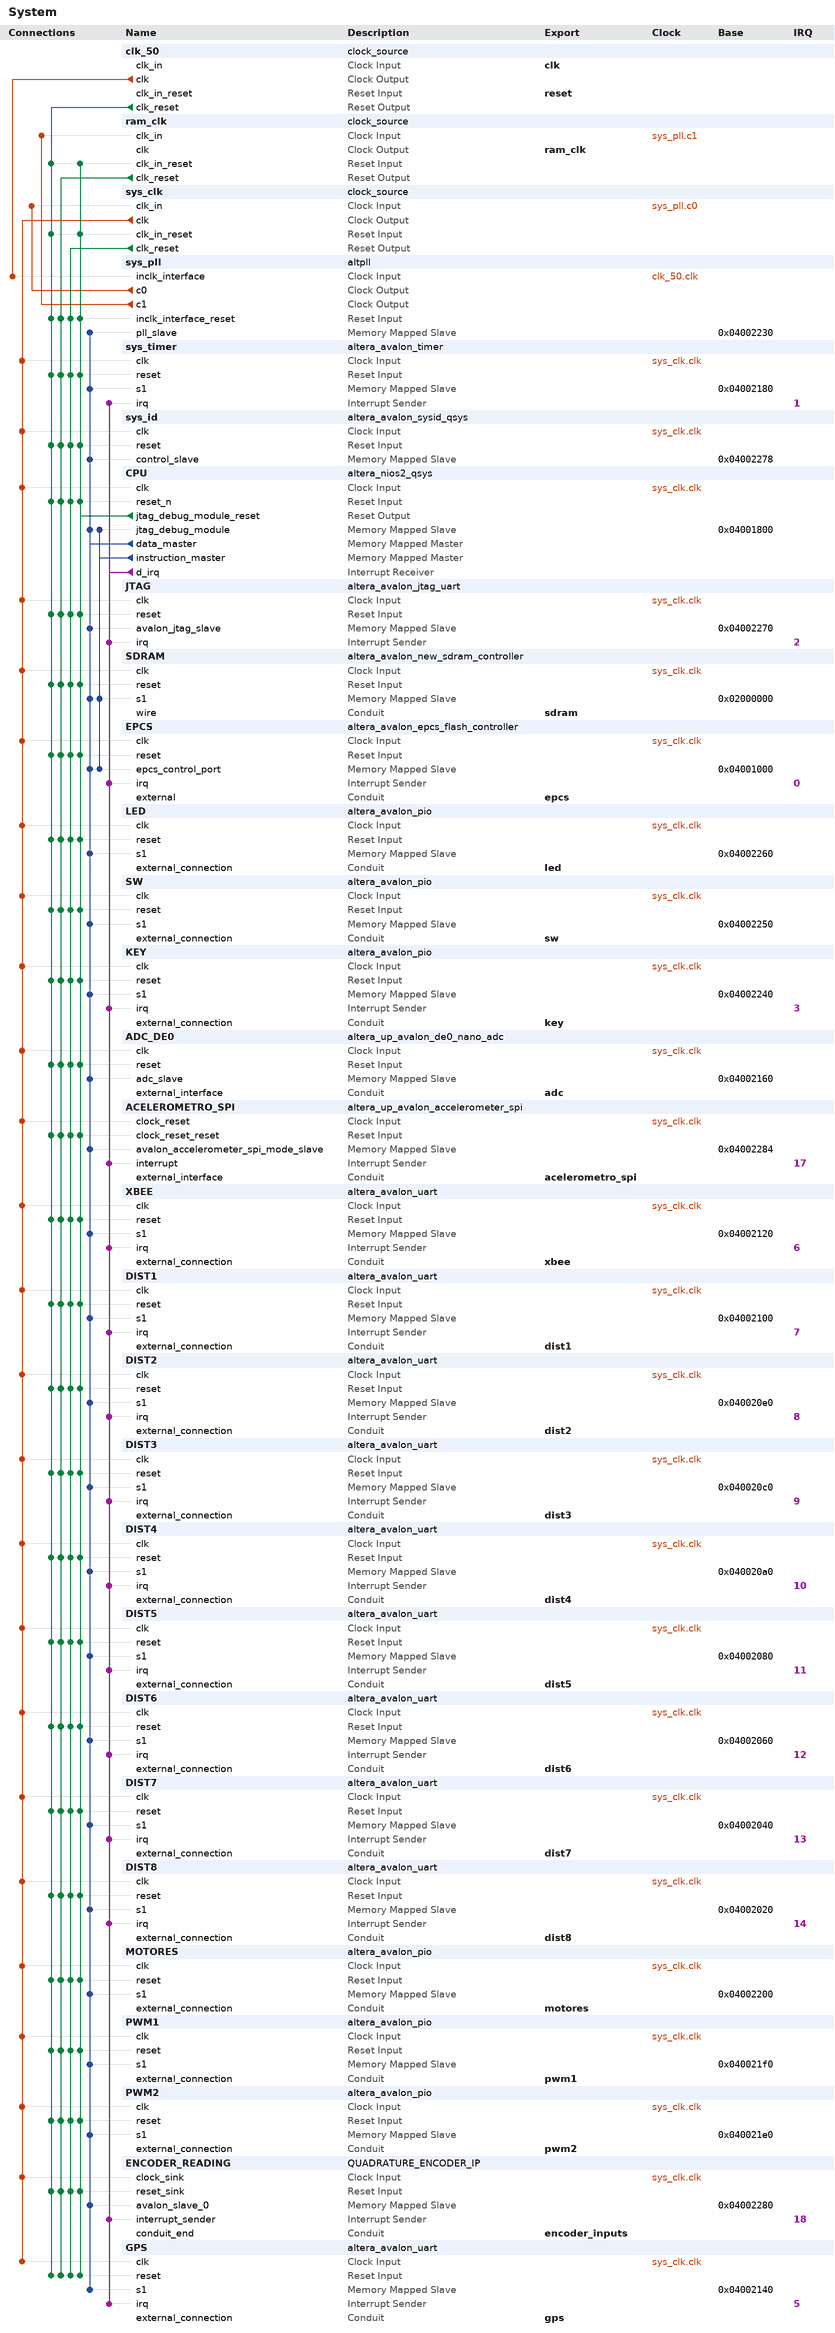
[diagram p0: system contents]
# Platform Designer (Qsys) system System, Cyclone IV E EP4CE22F17C6
# Parameters at their usual value, and those the tool derives, are not listed.
package require -exact qsys 13.1
create_system System
set_project_property DEVICE_FAMILY {Cyclone IV E}
set_project_property DEVICE EP4CE22F17C6

add_instance clk_50 clock_source 13.1
set_instance_parameter_value clk_50 clockFrequency 50000000

add_instance ram_clk clock_source 13.1
set_instance_parameter_value ram_clk clockFrequency 100000000

add_instance sys_clk clock_source 13.1
set_instance_parameter_value sys_clk clockFrequency 100000000

add_instance sys_pll altpll 13.1
set_instance_parameter_value sys_pll INCLK0_INPUT_FREQUENCY 20000
set_instance_parameter_value sys_pll CLK0_MULTIPLY_BY 2
set_instance_parameter_value sys_pll CLK1_MULTIPLY_BY 2
set_instance_parameter_value sys_pll CLK2_MULTIPLY_BY 1
set_instance_parameter_value sys_pll CLK0_DIVIDE_BY 1
set_instance_parameter_value sys_pll CLK1_DIVIDE_BY 1
set_instance_parameter_value sys_pll CLK2_DIVIDE_BY 250
set_instance_parameter_value sys_pll CLK1_PHASE_SHIFT -1667
set_instance_parameter_value sys_pll CLK2_PHASE_SHIFT 0
set_instance_parameter_value sys_pll CLK1_DUTY_CYCLE 50
set_instance_parameter_value sys_pll CLK2_DUTY_CYCLE 50
set_instance_parameter_value sys_pll PORT_clk1 PORT_USED
set_instance_parameter_value sys_pll PORT_clk2 PORT_USED
set_instance_parameter_value sys_pll PORT_clk3 PORT_UNUSED
set_instance_parameter_value sys_pll PORT_ARESET PORT_USED
set_instance_parameter_value sys_pll PORT_LOCKED PORT_USED

add_instance sys_timer altera_avalon_timer 13.1
set_instance_parameter_value sys_timer period 1
set_instance_parameter_value sys_timer periodUnits MSEC

add_instance sys_id altera_avalon_sysid_qsys 13.1
set_instance_parameter_value sys_id id 0

add_instance CPU altera_nios2_qsys 13.1
set_instance_parameter_value CPU resetSlave EPCS.epcs_control_port
set_instance_parameter_value CPU mmu_TLBMissExcSlave None
set_instance_parameter_value CPU exceptionSlave SDRAM.s1
set_instance_parameter_value CPU breakSlave CPU.jtag_debug_module
set_instance_parameter_value CPU impl Fast
set_instance_parameter_value CPU icache_size 4096

add_instance JTAG altera_avalon_jtag_uart 13.1
set_instance_parameter_value JTAG simInteractiveOptions NO_INTERACTIVE_WINDOWS

add_instance SDRAM altera_avalon_new_sdram_controller 13.1
set_instance_parameter_value SDRAM TAC 5.5
set_instance_parameter_value SDRAM TRCD 20.0
set_instance_parameter_value SDRAM TRP 20.0
set_instance_parameter_value SDRAM casLatency 3
set_instance_parameter_value SDRAM columnWidth 9
set_instance_parameter_value SDRAM dataWidth 16
set_instance_parameter_value SDRAM generateSimulationModel false
set_instance_parameter_value SDRAM model single_Micron_MT48LC4M32B2_7_chip
set_instance_parameter_value SDRAM numberOfBanks 4
set_instance_parameter_value SDRAM numberOfChipSelects 1
set_instance_parameter_value SDRAM powerUpDelay 100.0
set_instance_parameter_value SDRAM refreshPeriod 15.625
set_instance_parameter_value SDRAM rowWidth 13

add_instance EPCS altera_avalon_epcs_flash_controller 13.1

add_instance LED altera_avalon_pio 13.1
set_instance_parameter_value LED direction Output
set_instance_parameter_value LED width 8

add_instance SW altera_avalon_pio 13.1
set_instance_parameter_value SW direction Input
set_instance_parameter_value SW width 4

add_instance KEY altera_avalon_pio 13.1
set_instance_parameter_value KEY captureEdge true
set_instance_parameter_value KEY direction Input
set_instance_parameter_value KEY edgeType FALLING
set_instance_parameter_value KEY generateIRQ true
set_instance_parameter_value KEY irqType EDGE
set_instance_parameter_value KEY width 2

add_instance ADC_DE0 altera_up_avalon_de0_nano_adc 13.1
set_instance_parameter_value ADC_DE0 sclk_freq 1.0
set_instance_parameter_value ADC_DE0 numch 8

add_instance ACELEROMETRO_SPI altera_up_avalon_accelerometer_spi 13.1

add_instance XBEE altera_avalon_uart 13.1
set_instance_parameter_value XBEE baud 115200
set_instance_parameter_value XBEE dataBits 8
set_instance_parameter_value XBEE fixedBaud true
set_instance_parameter_value XBEE parity NONE
set_instance_parameter_value XBEE stopBits 1

add_instance DIST1 altera_avalon_uart 13.1
set_instance_parameter_value DIST1 baud 9600
set_instance_parameter_value DIST1 dataBits 8
set_instance_parameter_value DIST1 fixedBaud true
set_instance_parameter_value DIST1 parity NONE
set_instance_parameter_value DIST1 stopBits 1

add_instance DIST2 altera_avalon_uart 13.1
set_instance_parameter_value DIST2 baud 9600
set_instance_parameter_value DIST2 dataBits 8
set_instance_parameter_value DIST2 fixedBaud true
set_instance_parameter_value DIST2 parity NONE
set_instance_parameter_value DIST2 stopBits 1

add_instance DIST3 altera_avalon_uart 13.1
set_instance_parameter_value DIST3 baud 9600
set_instance_parameter_value DIST3 dataBits 8
set_instance_parameter_value DIST3 fixedBaud true
set_instance_parameter_value DIST3 parity NONE
set_instance_parameter_value DIST3 stopBits 1

add_instance DIST4 altera_avalon_uart 13.1
set_instance_parameter_value DIST4 baud 9600
set_instance_parameter_value DIST4 dataBits 8
set_instance_parameter_value DIST4 fixedBaud true
set_instance_parameter_value DIST4 parity NONE
set_instance_parameter_value DIST4 stopBits 1

add_instance DIST5 altera_avalon_uart 13.1
set_instance_parameter_value DIST5 baud 9600
set_instance_parameter_value DIST5 dataBits 8
set_instance_parameter_value DIST5 fixedBaud true
set_instance_parameter_value DIST5 parity NONE
set_instance_parameter_value DIST5 stopBits 1

add_instance DIST6 altera_avalon_uart 13.1
set_instance_parameter_value DIST6 baud 9600
set_instance_parameter_value DIST6 dataBits 8
set_instance_parameter_value DIST6 fixedBaud true
set_instance_parameter_value DIST6 parity NONE
set_instance_parameter_value DIST6 stopBits 1

add_instance DIST7 altera_avalon_uart 13.1
set_instance_parameter_value DIST7 baud 9600
set_instance_parameter_value DIST7 dataBits 8
set_instance_parameter_value DIST7 fixedBaud true
set_instance_parameter_value DIST7 parity NONE
set_instance_parameter_value DIST7 stopBits 1

add_instance DIST8 altera_avalon_uart 13.1
set_instance_parameter_value DIST8 baud 9600
set_instance_parameter_value DIST8 dataBits 8
set_instance_parameter_value DIST8 fixedBaud true
set_instance_parameter_value DIST8 parity NONE
set_instance_parameter_value DIST8 stopBits 1

add_instance MOTORES altera_avalon_pio 13.1
set_instance_parameter_value MOTORES direction Output
set_instance_parameter_value MOTORES width 6

add_instance PWM1 altera_avalon_pio 13.1
set_instance_parameter_value PWM1 direction Output
set_instance_parameter_value PWM1 width 8

add_instance PWM2 altera_avalon_pio 13.1
set_instance_parameter_value PWM2 direction Output
set_instance_parameter_value PWM2 width 8

add_instance ENCODER_READING QUADRATURE_ENCODER_IP 1.0
set_instance_parameter_value ENCODER_READING CLK_FREQ 100000000
set_instance_parameter_value ENCODER_READING TM_S 100
set_instance_parameter_value ENCODER_READING RESET_ON_READ 1
set_instance_parameter_value ENCODER_READING N 8
set_instance_parameter_value ENCODER_READING DEBOUNCE_CYCLES 1

add_instance GPS altera_avalon_uart 13.1
set_instance_parameter_value GPS baud 9600
set_instance_parameter_value GPS dataBits 8
set_instance_parameter_value GPS fixedBaud true
set_instance_parameter_value GPS parity NONE
set_instance_parameter_value GPS stopBits 1

# connections
add_connection clk_50.clk sys_pll.inclk_interface clock
add_connection sys_clk.clk ACELEROMETRO_SPI.clock_reset clock
add_connection sys_clk.clk ADC_DE0.clk clock
add_connection sys_clk.clk CPU.clk clock
add_connection sys_clk.clk DIST1.clk clock
add_connection sys_clk.clk DIST2.clk clock
add_connection sys_clk.clk DIST3.clk clock
add_connection sys_clk.clk DIST4.clk clock
add_connection sys_clk.clk DIST5.clk clock
add_connection sys_clk.clk DIST6.clk clock
add_connection sys_clk.clk DIST7.clk clock
add_connection sys_clk.clk DIST8.clk clock
add_connection sys_clk.clk ENCODER_READING.clock_sink clock
add_connection sys_clk.clk EPCS.clk clock
add_connection sys_clk.clk GPS.clk clock
add_connection sys_clk.clk JTAG.clk clock
add_connection sys_clk.clk KEY.clk clock
add_connection sys_clk.clk LED.clk clock
add_connection sys_clk.clk MOTORES.clk clock
add_connection sys_clk.clk PWM1.clk clock
add_connection sys_clk.clk PWM2.clk clock
add_connection sys_clk.clk SDRAM.clk clock
add_connection sys_clk.clk SW.clk clock
add_connection sys_clk.clk sys_id.clk clock
add_connection sys_clk.clk sys_timer.clk clock
add_connection sys_clk.clk XBEE.clk clock
add_connection sys_pll.c0 sys_clk.clk_in clock
add_connection sys_pll.c1 ram_clk.clk_in clock
add_connection clk_50.clk_reset ACELEROMETRO_SPI.clock_reset_reset reset
add_connection clk_50.clk_reset ADC_DE0.reset reset
add_connection clk_50.clk_reset CPU.reset_n reset
add_connection clk_50.clk_reset DIST1.reset reset
add_connection clk_50.clk_reset DIST2.reset reset
add_connection clk_50.clk_reset DIST3.reset reset
add_connection clk_50.clk_reset DIST4.reset reset
add_connection clk_50.clk_reset DIST5.reset reset
add_connection clk_50.clk_reset DIST6.reset reset
add_connection clk_50.clk_reset DIST7.reset reset
add_connection clk_50.clk_reset DIST8.reset reset
add_connection clk_50.clk_reset ENCODER_READING.reset_sink reset
add_connection clk_50.clk_reset EPCS.reset reset
add_connection clk_50.clk_reset GPS.reset reset
add_connection clk_50.clk_reset JTAG.reset reset
add_connection clk_50.clk_reset KEY.reset reset
add_connection clk_50.clk_reset LED.reset reset
add_connection clk_50.clk_reset MOTORES.reset reset
add_connection clk_50.clk_reset PWM1.reset reset
add_connection clk_50.clk_reset PWM2.reset reset
add_connection clk_50.clk_reset ram_clk.clk_in_reset reset
add_connection clk_50.clk_reset SDRAM.reset reset
add_connection clk_50.clk_reset SW.reset reset
add_connection clk_50.clk_reset sys_clk.clk_in_reset reset
add_connection clk_50.clk_reset sys_id.reset reset
add_connection clk_50.clk_reset sys_pll.inclk_interface_reset reset
add_connection clk_50.clk_reset sys_timer.reset reset
add_connection clk_50.clk_reset XBEE.reset reset
add_connection CPU.jtag_debug_module_reset ACELEROMETRO_SPI.clock_reset_reset reset
add_connection CPU.jtag_debug_module_reset ADC_DE0.reset reset
add_connection CPU.jtag_debug_module_reset CPU.reset_n reset
add_connection CPU.jtag_debug_module_reset DIST1.reset reset
add_connection CPU.jtag_debug_module_reset DIST2.reset reset
add_connection CPU.jtag_debug_module_reset DIST3.reset reset
add_connection CPU.jtag_debug_module_reset DIST4.reset reset
add_connection CPU.jtag_debug_module_reset DIST5.reset reset
add_connection CPU.jtag_debug_module_reset DIST6.reset reset
add_connection CPU.jtag_debug_module_reset DIST7.reset reset
add_connection CPU.jtag_debug_module_reset DIST8.reset reset
add_connection CPU.jtag_debug_module_reset ENCODER_READING.reset_sink reset
add_connection CPU.jtag_debug_module_reset EPCS.reset reset
add_connection CPU.jtag_debug_module_reset GPS.reset reset
add_connection CPU.jtag_debug_module_reset JTAG.reset reset
add_connection CPU.jtag_debug_module_reset KEY.reset reset
add_connection CPU.jtag_debug_module_reset LED.reset reset
add_connection CPU.jtag_debug_module_reset MOTORES.reset reset
add_connection CPU.jtag_debug_module_reset PWM1.reset reset
add_connection CPU.jtag_debug_module_reset PWM2.reset reset
add_connection CPU.jtag_debug_module_reset ram_clk.clk_in_reset reset
add_connection CPU.jtag_debug_module_reset SDRAM.reset reset
add_connection CPU.jtag_debug_module_reset SW.reset reset
add_connection CPU.jtag_debug_module_reset sys_clk.clk_in_reset reset
add_connection CPU.jtag_debug_module_reset sys_id.reset reset
add_connection CPU.jtag_debug_module_reset sys_pll.inclk_interface_reset reset
add_connection CPU.jtag_debug_module_reset sys_timer.reset reset
add_connection CPU.jtag_debug_module_reset XBEE.reset reset
add_connection ram_clk.clk_reset ACELEROMETRO_SPI.clock_reset_reset reset
add_connection ram_clk.clk_reset ADC_DE0.reset reset
add_connection ram_clk.clk_reset CPU.reset_n reset
add_connection ram_clk.clk_reset DIST1.reset reset
add_connection ram_clk.clk_reset DIST2.reset reset
add_connection ram_clk.clk_reset DIST3.reset reset
add_connection ram_clk.clk_reset DIST4.reset reset
add_connection ram_clk.clk_reset DIST5.reset reset
add_connection ram_clk.clk_reset DIST6.reset reset
add_connection ram_clk.clk_reset DIST7.reset reset
add_connection ram_clk.clk_reset DIST8.reset reset
add_connection ram_clk.clk_reset ENCODER_READING.reset_sink reset
add_connection ram_clk.clk_reset EPCS.reset reset
add_connection ram_clk.clk_reset GPS.reset reset
add_connection ram_clk.clk_reset JTAG.reset reset
add_connection ram_clk.clk_reset KEY.reset reset
add_connection ram_clk.clk_reset LED.reset reset
add_connection ram_clk.clk_reset MOTORES.reset reset
add_connection ram_clk.clk_reset PWM1.reset reset
add_connection ram_clk.clk_reset PWM2.reset reset
add_connection ram_clk.clk_reset SDRAM.reset reset
add_connection ram_clk.clk_reset SW.reset reset
add_connection ram_clk.clk_reset sys_id.reset reset
add_connection ram_clk.clk_reset sys_pll.inclk_interface_reset reset
add_connection ram_clk.clk_reset sys_timer.reset reset
add_connection ram_clk.clk_reset XBEE.reset reset
add_connection sys_clk.clk_reset ACELEROMETRO_SPI.clock_reset_reset reset
add_connection sys_clk.clk_reset ADC_DE0.reset reset
add_connection sys_clk.clk_reset CPU.reset_n reset
add_connection sys_clk.clk_reset DIST1.reset reset
add_connection sys_clk.clk_reset DIST2.reset reset
add_connection sys_clk.clk_reset DIST3.reset reset
add_connection sys_clk.clk_reset DIST4.reset reset
add_connection sys_clk.clk_reset DIST5.reset reset
add_connection sys_clk.clk_reset DIST6.reset reset
add_connection sys_clk.clk_reset DIST7.reset reset
add_connection sys_clk.clk_reset DIST8.reset reset
add_connection sys_clk.clk_reset ENCODER_READING.reset_sink reset
add_connection sys_clk.clk_reset EPCS.reset reset
add_connection sys_clk.clk_reset GPS.reset reset
add_connection sys_clk.clk_reset JTAG.reset reset
add_connection sys_clk.clk_reset KEY.reset reset
add_connection sys_clk.clk_reset LED.reset reset
add_connection sys_clk.clk_reset MOTORES.reset reset
add_connection sys_clk.clk_reset PWM1.reset reset
add_connection sys_clk.clk_reset PWM2.reset reset
add_connection sys_clk.clk_reset SDRAM.reset reset
add_connection sys_clk.clk_reset SW.reset reset
add_connection sys_clk.clk_reset sys_id.reset reset
add_connection sys_clk.clk_reset sys_pll.inclk_interface_reset reset
add_connection sys_clk.clk_reset sys_timer.reset reset
add_connection sys_clk.clk_reset XBEE.reset reset
add_connection CPU.data_master ACELEROMETRO_SPI.avalon_accelerometer_spi_mode_slave avalon
set_connection_parameter_value CPU.data_master/ACELEROMETRO_SPI.avalon_accelerometer_spi_mode_slave baseAddress 0x04002284
add_connection CPU.data_master ADC_DE0.adc_slave avalon
set_connection_parameter_value CPU.data_master/ADC_DE0.adc_slave baseAddress 0x04002160
add_connection CPU.data_master CPU.jtag_debug_module avalon
set_connection_parameter_value CPU.data_master/CPU.jtag_debug_module baseAddress 0x04001800
add_connection CPU.data_master DIST1.s1 avalon
set_connection_parameter_value CPU.data_master/DIST1.s1 baseAddress 0x04002100
add_connection CPU.data_master DIST2.s1 avalon
set_connection_parameter_value CPU.data_master/DIST2.s1 baseAddress 0x040020e0
add_connection CPU.data_master DIST3.s1 avalon
set_connection_parameter_value CPU.data_master/DIST3.s1 baseAddress 0x040020c0
add_connection CPU.data_master DIST4.s1 avalon
set_connection_parameter_value CPU.data_master/DIST4.s1 baseAddress 0x040020a0
add_connection CPU.data_master DIST5.s1 avalon
set_connection_parameter_value CPU.data_master/DIST5.s1 baseAddress 0x04002080
add_connection CPU.data_master DIST6.s1 avalon
set_connection_parameter_value CPU.data_master/DIST6.s1 baseAddress 0x04002060
add_connection CPU.data_master DIST7.s1 avalon
set_connection_parameter_value CPU.data_master/DIST7.s1 baseAddress 0x04002040
add_connection CPU.data_master DIST8.s1 avalon
set_connection_parameter_value CPU.data_master/DIST8.s1 baseAddress 0x04002020
add_connection CPU.data_master ENCODER_READING.avalon_slave_0 avalon
set_connection_parameter_value CPU.data_master/ENCODER_READING.avalon_slave_0 baseAddress 0x04002280
add_connection CPU.data_master EPCS.epcs_control_port avalon
set_connection_parameter_value CPU.data_master/EPCS.epcs_control_port baseAddress 0x04001000
add_connection CPU.data_master GPS.s1 avalon
set_connection_parameter_value CPU.data_master/GPS.s1 baseAddress 0x04002140
add_connection CPU.data_master JTAG.avalon_jtag_slave avalon
set_connection_parameter_value CPU.data_master/JTAG.avalon_jtag_slave baseAddress 0x04002270
add_connection CPU.data_master KEY.s1 avalon
set_connection_parameter_value CPU.data_master/KEY.s1 baseAddress 0x04002240
add_connection CPU.data_master LED.s1 avalon
set_connection_parameter_value CPU.data_master/LED.s1 baseAddress 0x04002260
add_connection CPU.data_master MOTORES.s1 avalon
set_connection_parameter_value CPU.data_master/MOTORES.s1 baseAddress 0x04002200
add_connection CPU.data_master PWM1.s1 avalon
set_connection_parameter_value CPU.data_master/PWM1.s1 baseAddress 0x040021f0
add_connection CPU.data_master PWM2.s1 avalon
set_connection_parameter_value CPU.data_master/PWM2.s1 baseAddress 0x040021e0
add_connection CPU.data_master SDRAM.s1 avalon
set_connection_parameter_value CPU.data_master/SDRAM.s1 baseAddress 0x02000000
add_connection CPU.data_master SW.s1 avalon
set_connection_parameter_value CPU.data_master/SW.s1 baseAddress 0x04002250
add_connection CPU.data_master sys_id.control_slave avalon
set_connection_parameter_value CPU.data_master/sys_id.control_slave baseAddress 0x04002278
add_connection CPU.data_master sys_pll.pll_slave avalon
set_connection_parameter_value CPU.data_master/sys_pll.pll_slave baseAddress 0x04002230
add_connection CPU.data_master sys_timer.s1 avalon
set_connection_parameter_value CPU.data_master/sys_timer.s1 baseAddress 0x04002180
add_connection CPU.data_master XBEE.s1 avalon
set_connection_parameter_value CPU.data_master/XBEE.s1 baseAddress 0x04002120
add_connection CPU.instruction_master CPU.jtag_debug_module avalon
set_connection_parameter_value CPU.instruction_master/CPU.jtag_debug_module baseAddress 0x04001800
add_connection CPU.instruction_master EPCS.epcs_control_port avalon
set_connection_parameter_value CPU.instruction_master/EPCS.epcs_control_port baseAddress 0x04001000
add_connection CPU.instruction_master SDRAM.s1 avalon
set_connection_parameter_value CPU.instruction_master/SDRAM.s1 baseAddress 0x02000000
add_connection CPU.d_irq ACELEROMETRO_SPI.interrupt interrupt
set_connection_parameter_value CPU.d_irq/ACELEROMETRO_SPI.interrupt irqNumber 17
add_connection CPU.d_irq DIST1.irq interrupt
set_connection_parameter_value CPU.d_irq/DIST1.irq irqNumber 7
add_connection CPU.d_irq DIST2.irq interrupt
set_connection_parameter_value CPU.d_irq/DIST2.irq irqNumber 8
add_connection CPU.d_irq DIST3.irq interrupt
set_connection_parameter_value CPU.d_irq/DIST3.irq irqNumber 9
add_connection CPU.d_irq DIST4.irq interrupt
set_connection_parameter_value CPU.d_irq/DIST4.irq irqNumber 10
add_connection CPU.d_irq DIST5.irq interrupt
set_connection_parameter_value CPU.d_irq/DIST5.irq irqNumber 11
add_connection CPU.d_irq DIST6.irq interrupt
set_connection_parameter_value CPU.d_irq/DIST6.irq irqNumber 12
add_connection CPU.d_irq DIST7.irq interrupt
set_connection_parameter_value CPU.d_irq/DIST7.irq irqNumber 13
add_connection CPU.d_irq DIST8.irq interrupt
set_connection_parameter_value CPU.d_irq/DIST8.irq irqNumber 14
add_connection CPU.d_irq ENCODER_READING.interrupt_sender interrupt
set_connection_parameter_value CPU.d_irq/ENCODER_READING.interrupt_sender irqNumber 18
add_connection CPU.d_irq EPCS.irq interrupt
set_connection_parameter_value CPU.d_irq/EPCS.irq irqNumber 0
add_connection CPU.d_irq GPS.irq interrupt
set_connection_parameter_value CPU.d_irq/GPS.irq irqNumber 5
add_connection CPU.d_irq JTAG.irq interrupt
set_connection_parameter_value CPU.d_irq/JTAG.irq irqNumber 2
add_connection CPU.d_irq KEY.irq interrupt
set_connection_parameter_value CPU.d_irq/KEY.irq irqNumber 3
add_connection CPU.d_irq sys_timer.irq interrupt
set_connection_parameter_value CPU.d_irq/sys_timer.irq irqNumber 1
add_connection CPU.d_irq XBEE.irq interrupt
set_connection_parameter_value CPU.d_irq/XBEE.irq irqNumber 6

# exported interfaces
add_interface clk clock sink
set_interface_property clk EXPORT_OF clk_50.clk_in
add_interface reset reset sink
set_interface_property reset EXPORT_OF clk_50.clk_in_reset
add_interface sdram conduit end
set_interface_property sdram EXPORT_OF SDRAM.wire
add_interface epcs conduit end
set_interface_property epcs EXPORT_OF EPCS.external
add_interface led conduit end
set_interface_property led EXPORT_OF LED.external_connection
add_interface sw conduit end
set_interface_property sw EXPORT_OF SW.external_connection
add_interface key conduit end
set_interface_property key EXPORT_OF KEY.external_connection
add_interface ram_clk clock source
set_interface_property ram_clk EXPORT_OF ram_clk.clk
add_interface adc conduit end
set_interface_property adc EXPORT_OF ADC_DE0.external_interface
add_interface motores conduit end
set_interface_property motores EXPORT_OF MOTORES.external_connection
add_interface pwm1 conduit end
set_interface_property pwm1 EXPORT_OF PWM1.external_connection
add_interface pwm2 conduit end
set_interface_property pwm2 EXPORT_OF PWM2.external_connection
add_interface gps conduit end
set_interface_property gps EXPORT_OF GPS.external_connection
add_interface xbee conduit end
set_interface_property xbee EXPORT_OF XBEE.external_connection
add_interface dist1 conduit end
set_interface_property dist1 EXPORT_OF DIST1.external_connection
add_interface dist2 conduit end
set_interface_property dist2 EXPORT_OF DIST2.external_connection
add_interface dist3 conduit end
set_interface_property dist3 EXPORT_OF DIST3.external_connection
add_interface dist4 conduit end
set_interface_property dist4 EXPORT_OF DIST4.external_connection
add_interface dist5 conduit end
set_interface_property dist5 EXPORT_OF DIST5.external_connection
add_interface dist6 conduit end
set_interface_property dist6 EXPORT_OF DIST6.external_connection
add_interface dist7 conduit end
set_interface_property dist7 EXPORT_OF DIST7.external_connection
add_interface dist8 conduit end
set_interface_property dist8 EXPORT_OF DIST8.external_connection
add_interface acelerometro_spi conduit end
set_interface_property acelerometro_spi EXPORT_OF ACELEROMETRO_SPI.external_interface
add_interface encoder_inputs conduit end
set_interface_property encoder_inputs EXPORT_OF ENCODER_READING.conduit_end

set_interconnect_requirement {$system} qsys_mm.clockCrossingAdapter HANDSHAKE
set_interconnect_requirement {$system} qsys_mm.maxAdditionalLatency 1
set_interconnect_requirement {$system} qsys_mm.insertDefaultSlave false

save_system System.qsys
